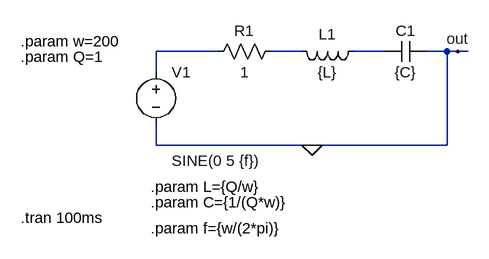
[diagram p0: schematic Circuito RLC serie.asc]
Circuito RLC serie.asc, the LTspice schematic file:
Version 4
SHEET 1 880 680
WIRE 128 96 32 96
WIRE 256 96 208 96
WIRE 384 96 336 96
WIRE 480 96 448 96
WIRE 496 96 480 96
WIRE 512 96 496 96
WIRE 32 128 32 96
WIRE 32 240 32 208
WIRE 272 240 32 240
WIRE 480 240 480 96
WIRE 480 240 272 240
FLAG 272 240 0
FLAG 496 96 out
SYMBOL voltage 32 112 R0
WINDOW 3 24 152 Left 2
WINDOW 123 24 124 Left 2
WINDOW 39 0 0 Left 0
SYMATTR Value SINE(0 5 {f})
SYMATTR InstName V1
SYMBOL res 224 80 R90
WINDOW 0 0 56 VBottom 2
WINDOW 3 32 56 VTop 2
SYMATTR InstName R1
SYMATTR Value 1
SYMBOL ind 352 80 R90
WINDOW 0 5 56 VBottom 2
WINDOW 3 32 56 VTop 2
SYMATTR InstName L1
SYMATTR Value {L}
SYMBOL cap 448 80 R90
WINDOW 0 0 32 VBottom 2
WINDOW 3 32 32 VTop 2
SYMATTR InstName C1
SYMATTR Value {C}
TEXT -176 80 Left 2 !.param w=200
TEXT -176 104 Left 2 !.param Q=1
TEXT 24 304 Left 2 !.param L={Q/w}
TEXT 24 328 Left 2 !.param C={1/(Q*w)}
TEXT -176 352 Left 2 !.tran 100ms
TEXT 24 368 Left 2 !.param f={w/(2*pi)}

The netlist it stands for:
* Circuito RLC serie.asc
V1 N001 0 SINE(0 5 {f})
R1 N002 N001 1
L1 N003 N002 {L}
C1 0 N003 {C}
.param w=200
.param Q=1
.param L={Q/w}
.param C={1/(Q*w)}
.tran 100ms
.param f={w/(2*pi)}
.backanno
.end